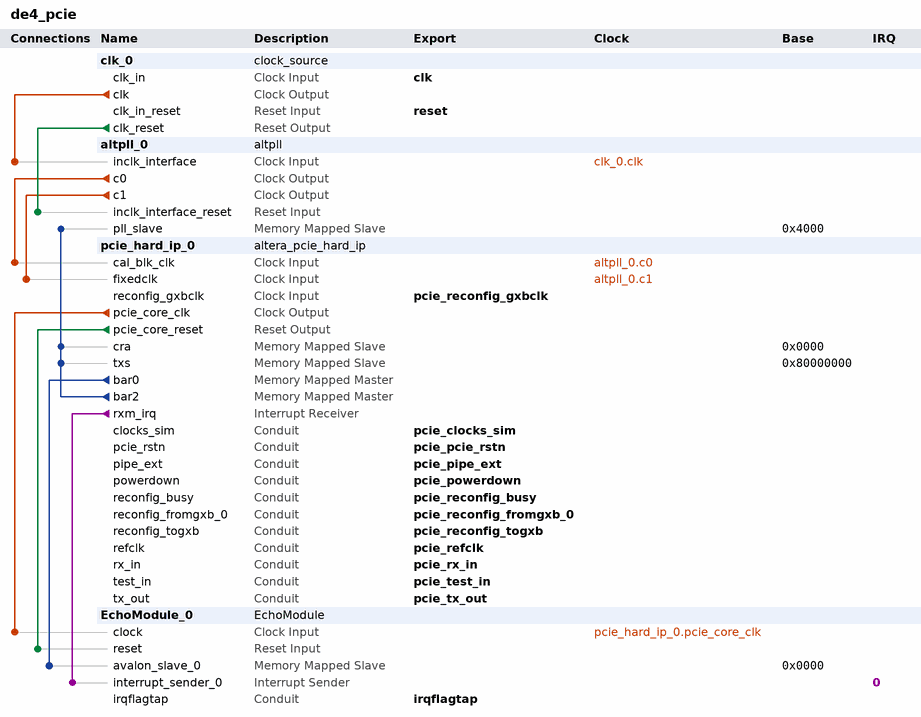
[diagram p0: system contents]
# Platform Designer (Qsys) system de4_pcie, Stratix IV EP4SGX230KF40C2
# Parameters at their usual value, and those the tool derives, are not listed.
package require -exact qsys 14.1
create_system de4_pcie
set_project_property DEVICE_FAMILY {Stratix IV}
set_project_property DEVICE EP4SGX230KF40C2

add_instance clk_0 clock_source 14.1
set_instance_parameter_value clk_0 clockFrequency 50000000

add_instance altpll_0 altpll 14.1
set_instance_parameter_value altpll_0 CLK0_DIVIDE_BY 1
set_instance_parameter_value altpll_0 CLK0_MULTIPLY_BY 1
set_instance_parameter_value altpll_0 CLK1_DIVIDE_BY 2
set_instance_parameter_value altpll_0 CLK1_DUTY_CYCLE 50
set_instance_parameter_value altpll_0 CLK1_MULTIPLY_BY 5
set_instance_parameter_value altpll_0 CLK1_PHASE_SHIFT 0
set_instance_parameter_value altpll_0 INCLK0_INPUT_FREQUENCY 20000
set_instance_parameter_value altpll_0 PORT_ARESET PORT_UNUSED
set_instance_parameter_value altpll_0 PORT_FBOUT PORT_UNUSED
set_instance_parameter_value altpll_0 PORT_LOCKED PORT_UNUSED
set_instance_parameter_value altpll_0 PORT_clk1 PORT_USED
set_instance_parameter_value altpll_0 PORT_clk2 PORT_UNUSED
set_instance_parameter_value altpll_0 PORT_clk3 PORT_UNUSED
set_instance_parameter_value altpll_0 PORT_clk6 PORT_UNUSED
set_instance_parameter_value altpll_0 PORT_clk7 PORT_UNUSED
set_instance_parameter_value altpll_0 PORT_clk8 PORT_UNUSED
set_instance_parameter_value altpll_0 PORT_clk9 PORT_UNUSED
set_instance_parameter_value altpll_0 USING_FBMIMICBIDIR_PORT OFF
set_instance_parameter_value altpll_0 WIDTH_CLOCK 10

add_instance pcie_hard_ip_0 altera_pcie_hard_ip 14.1
set_instance_parameter_value pcie_hard_ip_0 {BAR Type} {32 bit Non-Prefetchable,Not used,32 bit Non-Prefetchable,Not used,Not used,Not used}
set_instance_parameter_value pcie_hard_ip_0 CB_A2P_ADDR_MAP_PASS_THRU_BITS 31
set_instance_parameter_value pcie_hard_ip_0 CG_ENABLE_A2P_INTERRUPT 1
set_instance_parameter_value pcie_hard_ip_0 CG_NO_CPL_REORDERING 0
set_instance_parameter_value pcie_hard_ip_0 {PCIe Address 31:0} 0x00000000,0x00000000,0x00000000,0x00000000,0x00000000,0x00000000,0x00000000,0x00000000,0x00000000,0x00000000,0x00000000,0x00000000,0x00000000,0x00000000,0x00000000,0x00000000
set_instance_parameter_value pcie_hard_ip_0 {PCIe Address 63:32} 0x00000000,0x00000000,0x00000000,0x00000000,0x00000000,0x00000000,0x00000000,0x00000000,0x00000000,0x00000000,0x00000000,0x00000000,0x00000000,0x00000000,0x00000000,0x00000000
set_instance_parameter_value pcie_hard_ip_0 class_code 0
set_instance_parameter_value pcie_hard_ip_0 device_id 3556
set_instance_parameter_value pcie_hard_ip_0 max_link_width 4
set_instance_parameter_value pcie_hard_ip_0 my_advanced_errors false
set_instance_parameter_value pcie_hard_ip_0 my_enable_ecrc_check false
set_instance_parameter_value pcie_hard_ip_0 my_enable_ecrc_gen false
set_instance_parameter_value pcie_hard_ip_0 p_pcie_test_out_width None
set_instance_parameter_value pcie_hard_ip_0 p_user_msi_enable 0
set_instance_parameter_value pcie_hard_ip_0 subsystem_device_id 4
set_instance_parameter_value pcie_hard_ip_0 subsystem_vendor_id 4466
set_instance_parameter_value pcie_hard_ip_0 vendor_id 4466

add_instance EchoModule_0 EchoModule 1.0

# connections
add_connection altpll_0.c0 pcie_hard_ip_0.cal_blk_clk clock
add_connection altpll_0.c1 pcie_hard_ip_0.fixedclk clock
add_connection clk_0.clk altpll_0.inclk_interface clock
add_connection pcie_hard_ip_0.pcie_core_clk EchoModule_0.clock clock
add_connection clk_0.clk_reset altpll_0.inclk_interface_reset reset
add_connection pcie_hard_ip_0.pcie_core_reset EchoModule_0.reset reset
add_connection pcie_hard_ip_0.bar0 EchoModule_0.avalon_slave_0 avalon
set_connection_parameter_value pcie_hard_ip_0.bar0/EchoModule_0.avalon_slave_0 baseAddress 0x0000
add_connection pcie_hard_ip_0.bar2 altpll_0.pll_slave avalon
set_connection_parameter_value pcie_hard_ip_0.bar2/altpll_0.pll_slave baseAddress 0x4000
add_connection pcie_hard_ip_0.bar2 pcie_hard_ip_0.cra avalon
set_connection_parameter_value pcie_hard_ip_0.bar2/pcie_hard_ip_0.cra baseAddress 0x0000
add_connection pcie_hard_ip_0.bar2 pcie_hard_ip_0.txs avalon
set_connection_parameter_value pcie_hard_ip_0.bar2/pcie_hard_ip_0.txs baseAddress 0x80000000
add_connection pcie_hard_ip_0.rxm_irq EchoModule_0.interrupt_sender_0 interrupt
set_connection_parameter_value pcie_hard_ip_0.rxm_irq/EchoModule_0.interrupt_sender_0 irqNumber 0

# exported interfaces
add_interface clk clock sink
set_interface_property clk EXPORT_OF clk_0.clk_in
add_interface irqflagtap conduit end
set_interface_property irqflagtap EXPORT_OF EchoModule_0.irqflagtap
add_interface pcie_clocks_sim conduit end
set_interface_property pcie_clocks_sim EXPORT_OF pcie_hard_ip_0.clocks_sim
add_interface pcie_pcie_rstn conduit end
set_interface_property pcie_pcie_rstn EXPORT_OF pcie_hard_ip_0.pcie_rstn
add_interface pcie_pipe_ext conduit end
set_interface_property pcie_pipe_ext EXPORT_OF pcie_hard_ip_0.pipe_ext
add_interface pcie_powerdown conduit end
set_interface_property pcie_powerdown EXPORT_OF pcie_hard_ip_0.powerdown
add_interface pcie_reconfig_busy conduit end
set_interface_property pcie_reconfig_busy EXPORT_OF pcie_hard_ip_0.reconfig_busy
add_interface pcie_reconfig_fromgxb_0 conduit end
set_interface_property pcie_reconfig_fromgxb_0 EXPORT_OF pcie_hard_ip_0.reconfig_fromgxb_0
add_interface pcie_reconfig_gxbclk clock sink
set_interface_property pcie_reconfig_gxbclk EXPORT_OF pcie_hard_ip_0.reconfig_gxbclk
add_interface pcie_reconfig_togxb conduit end
set_interface_property pcie_reconfig_togxb EXPORT_OF pcie_hard_ip_0.reconfig_togxb
add_interface pcie_refclk conduit end
set_interface_property pcie_refclk EXPORT_OF pcie_hard_ip_0.refclk
add_interface pcie_rx_in conduit end
set_interface_property pcie_rx_in EXPORT_OF pcie_hard_ip_0.rx_in
add_interface pcie_test_in conduit end
set_interface_property pcie_test_in EXPORT_OF pcie_hard_ip_0.test_in
add_interface pcie_tx_out conduit end
set_interface_property pcie_tx_out EXPORT_OF pcie_hard_ip_0.tx_out
add_interface reset reset sink
set_interface_property reset EXPORT_OF clk_0.clk_in_reset

set_interconnect_requirement {$system} qsys_mm.clockCrossingAdapter HANDSHAKE
set_interconnect_requirement {$system} qsys_mm.insertDefaultSlave FALSE
set_interconnect_requirement {$system} qsys_mm.maxAdditionalLatency 1

save_system de4_pcie.qsys
